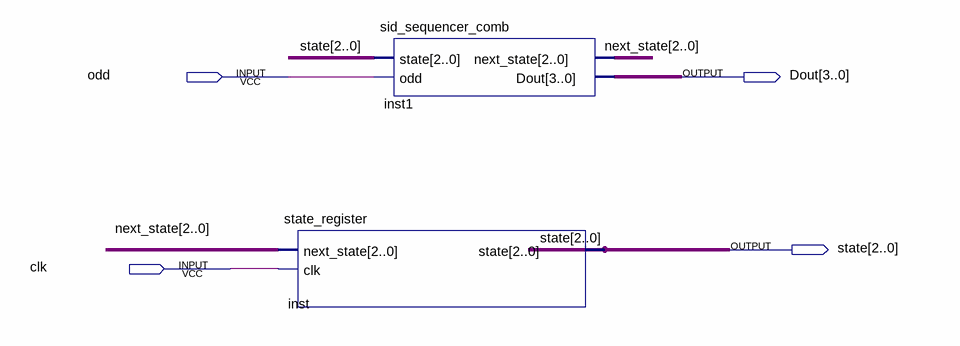
[diagram p0: schematic sheet]
// Quartus schematic sid_sequencer_fsm.bdf as structural Verilog: 2 symbols, 4 pins
module sid_sequencer_fsm (
  input  odd,
  input  clk,
  output [3:0] Dout,
  output [2:0] state
);

  wire [2:0] next_state;

  state_register inst (.next_state(next_state), .clk(clk), .state(state));
  sid_sequencer_comb inst1 (.state(state), .odd(odd), .next_state(next_state), .Dout(Dout));
endmodule
